# Altium schematic sheet MCU Board.SchDoc
size A; SheetNumber: 6; SheetTotal: 7
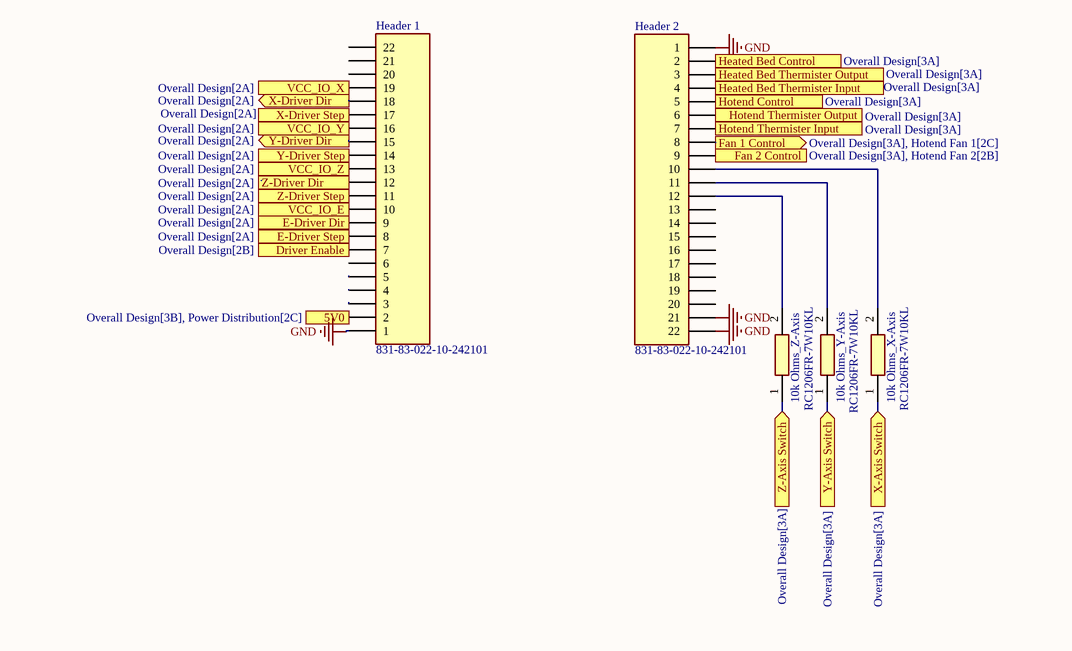
[diagram p0: MCU Board.SchDoc]

## Parts
10k_Ohms_X-Axis  RC1206FR-7W10KL  [RESC3116X65N]
10k_Ohms_Y-Axis  RC1206FR-7W10KL  [RESC3116X65N]
10k_Ohms_Z-Axis  RC1206FR-7W10KL  [RESC3116X65N]
Header_1  831-83-022-10-242101  [8318302210242101]
Header_2  831-83-022-10-242101  [8318302210242101]

## Ports
5V0 (in, see Overall Design[3B], Power Distribution[2C]), Driver Enable (out, see Overall Design[2B]), E-Driver Dir (out, see Overall Design[2A]), E-Driver Step (out, see Overall Design[2A]), Fan 1 Control (out, see Overall Design[3A], Hotend Fan 1[2C]), Fan 2 Control (out, see Overall Design[3A], Hotend Fan 2[2B]), Heated Bed Control (out, see Overall Design[3A]), Heated Bed Thermister Input (in, see Overall Design[3A]), Heated Bed Thermister Output (out, see Overall Design[3A]), Hotend Control (out, see Overall Design[3A]), Hotend Thermister Input (in, see Overall Design[3A]), Hotend Thermister Output (out, see Overall Design[3A]), VCC_IO_E (out, see Overall Design[2A]), VCC_IO_X (out, see Overall Design[2A]), VCC_IO_Y (out, see Overall Design[2A]), VCC_IO_Z (out, see Overall Design[2A]), X-Axis Switch (in, see Overall Design[3A]), X-Driver Dir (out, see Overall Design[2A]), X-Driver Step (out, see Overall Design[2A]), Y-Axis Switch (in, see Overall Design[3A]), Y-Driver Dir (out, see Overall Design[2A]), Y-Driver Step (out, see Overall Design[2A]), Z-Axis Switch (in, see Overall Design[3A]), Z-Driver Dir (out, see Overall Design[2A]), Z-Driver Step (out, see Overall Design[2A])

## Nets
GND: Header_1.1 Header_2.1 Header_2.21 Header_2.22
5V0: Header_1.2 ; port 5V0
Driver Enable: Header_1.7 ; port Driver Enable
E-Driver Dir: Header_1.9 ; port E-Driver Dir
E-Driver Step: Header_1.8 ; port E-Driver Step
Fan 1 Control: Header_2.8 ; port Fan 1 Control
Fan 2 Control: Header_2.9 ; port Fan 2 Control
Heated Bed Control: Header_2.2 ; port Heated Bed Control
Heated Bed Thermister Input: Header_2.4 ; port Heated Bed Thermister Input
Heated Bed Thermister Output: Header_2.3 ; port Heated Bed Thermister Output
Hotend Control: Header_2.5 ; port Hotend Control
Hotend Thermister Input: Header_2.7 ; port Hotend Thermister Input
Hotend Thermister Output: Header_2.6 ; port Hotend Thermister Output
VCC_IO_E: Header_1.10 ; port VCC_IO_E
VCC_IO_X: Header_1.19 ; port VCC_IO_X
VCC_IO_Y: Header_1.16 ; port VCC_IO_Y
VCC_IO_Z: Header_1.13 ; port VCC_IO_Z
X-Axis Switch: 10k_Ohms_X-Axis.1 ; port X-Axis Switch
X-Driver Dir: Header_1.18 ; port X-Driver Dir
X-Driver Step: Header_1.17 ; port X-Driver Step
Y-Axis Switch: 10k_Ohms_Y-Axis.1 ; port Y-Axis Switch
Y-Driver Dir: Header_1.15 ; port Y-Driver Dir
Y-Driver Step: Header_1.14 ; port Y-Driver Step
Z-Axis Switch: 10k_Ohms_Z-Axis.1 ; port Z-Axis Switch
Z-Driver Dir: Header_1.12 ; port Z-Driver Dir
Z-Driver Step: Header_1.11 ; port Z-Driver Step
Net10k_Ohms_X-Axis_2: 10k_Ohms_X-Axis.2 Header_2.10
Net10k_Ohms_Y-Axis_2: 10k_Ohms_Y-Axis.2 Header_2.11
Net10k_Ohms_Z-Axis_2: 10k_Ohms_Z-Axis.2 Header_2.12

Not connected (* = marked no-connect by the designer): Header_1 3 4 5 6 20 21 22; Header_2 13 14 15 16 17 18 19 20

## Library data of the parts
10k_Ohms_X-Axis 10k_Ohms_Y-Axis 10k_Ohms_Z-Axis = RC1206FR-7W10KL: Resistor; Manufacturer_Name: KEMET; Datasheet Link: https://datasheet.datasheetarchive.com/originals/distributors/Datasheets_SAMA/902f9e387b938f871d31120f5fc1d65e.pdf; Height: 0.65mm; Manufacturer_Part_Number: RC1206FR-7W10KL; Arrow Part Number: RC1206FR-7W10KL; Arrow Price/Stock: https://www.arrow.com/en/products/rc1206fr-7w10kl/yageo
Header_1 Header_2 = 831-83-022-10-242101: Connector; Manufacturer_Name: Preci-Dip; Datasheet Link: https://www.precidip.com/AppHost/9696,1/Scripts/Modules/Catalog/Default.aspx?c=7&i=195&p=78&pdf=1&dsku=831-PP-NNN-10-242101; Height: 4.55mm; Manufacturer_Part_Number: 831-83-022-10-242101